# EasyEDA Pro project ProDocument_PCB6_2024-05-04.epro

# Board PCB6
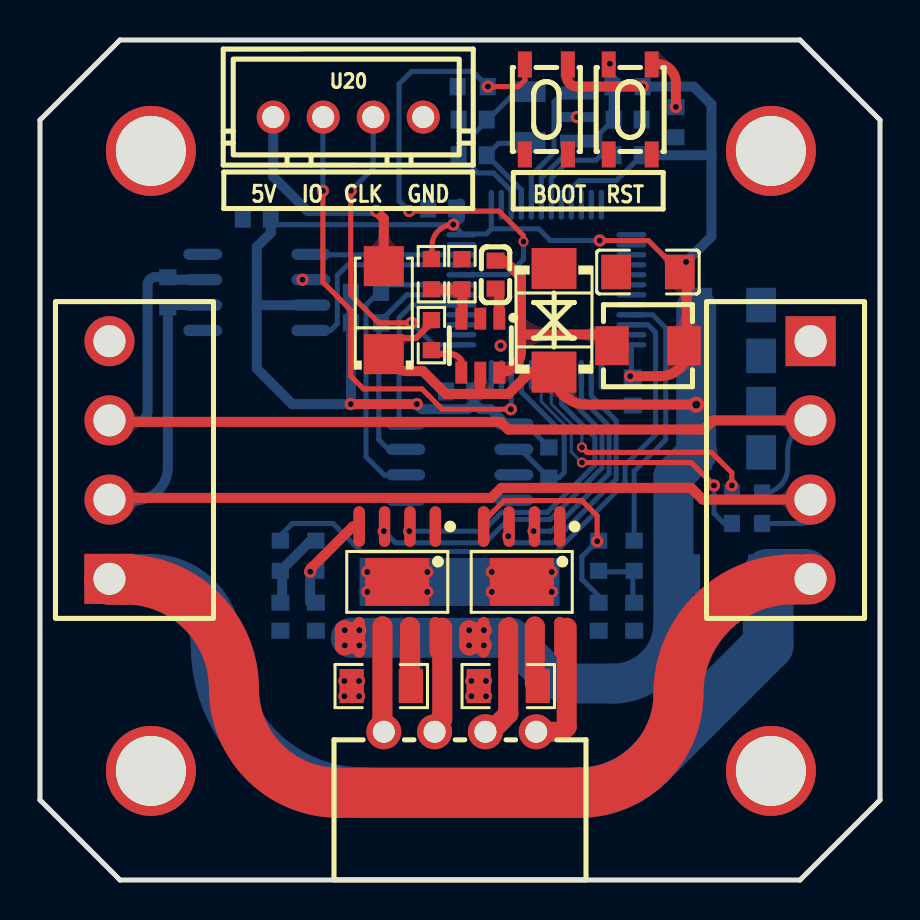
[diagram p0: board, top side]
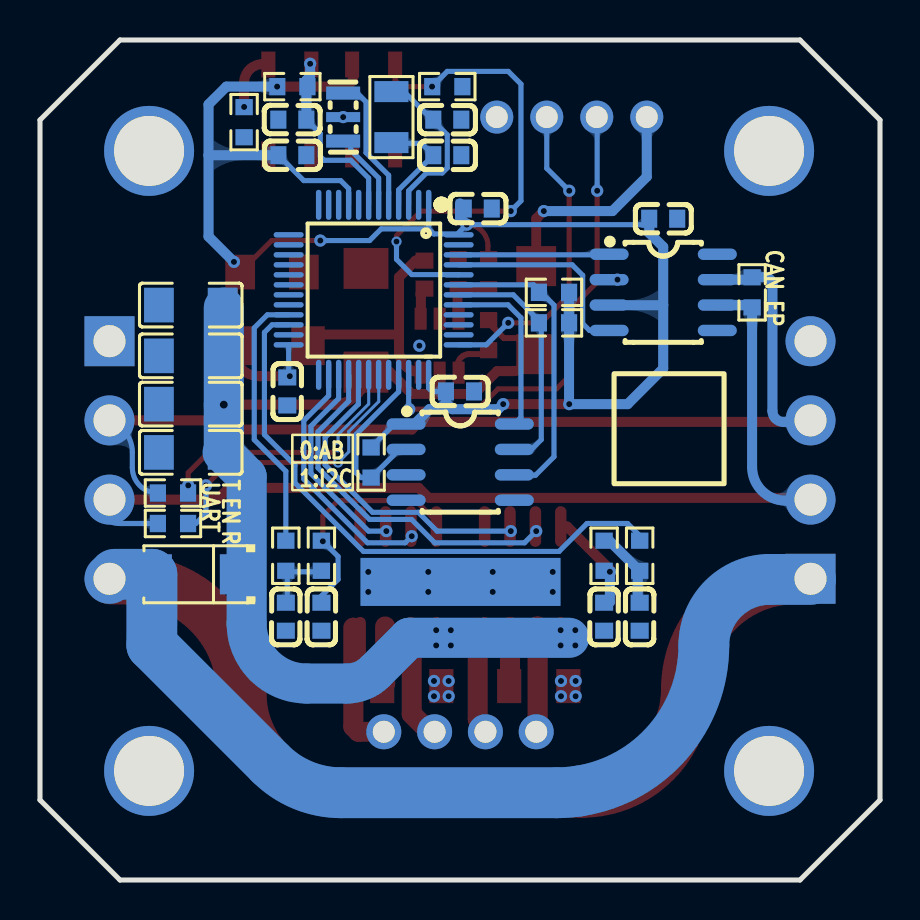
[diagram p1: board, bottom side, seen from below]

Outline 42 x 42 mm; copper layers: Top Layer, Bottom Layer. Coordinates in mm from the lower left corner of the outline.
Outline path: 0,38 0,4 4,0 38,0 42,4 42,38 38,42 4,42 0,38
Stack: Top Layer 0.035mm - / Dielectric1 1.51mm FR4 er 4.5 / Bottom Layer 0.035mm -

## Design rules (mm)
template: 自定义配置
spacing copperThickness1oz (default): track to track 0.102, other pairs 0.152 to 0.3
spacing copperThickness2oz: track to track 0.203, other pairs 0.152 to 0.3
track width copperThickness1oz (default): min 0.127, default 0.254, max 2.54
track width copperThickness2oz: min 0.203, default 0.254, max 2.54
differential pair differentialPair (default): width min 0.127, default 0.254, max 2.54; gap min 0.152, default 0.152
via viaSize (default): diameter min 0.5, default 0.61, max 10; hole min 0.3, default 0.305, max 6.3
net GND uses copperRegion1
net VM uses copperRegion1

## Placement (name value [footprint] x y rotation side)
C1  100nF  [C0603]  29.64 24.43 90 bottom
C2  100nF  [C0603]  29.38 36.24 0 bottom
C3  100nF  [C0603]  20.11 33.57 0 bottom
C4  100nF  [C0603]  22.78 30.27 90 top
C6  10uF  [C1206]  30.4 30.4 180 top
C7  100nF  [C0603]  21 24.43 0 bottom
C8  100nF  [C0603]  10.84 33.06 0 bottom
C9  100nF  [C0603]  29.71 13.16 90 bottom
C10  100nF  [C0603]  27.93 13.16 90 bottom
C11  100nF  [C0603]  12.02 13.16 90 bottom
C12  100nF  [C0603]  13.79 13.16 90 bottom
C13  10pF  [C0603]  21.64 38.02 0 bottom
C14  10pF  [C0603]  21.64 36.24 0 bottom
C15  100nF  [C0603]  29.38 38.02 180 bottom
C16  100uF  [C1206]  34.46 21.38 0 bottom
C17  100uF  [C1206]  34.46 23.79 0 bottom
C18  100uF  [C1206]  34.46 28.75 0 bottom
C19  100uF  [C1206]  34.46 26.21 0 bottom
CN3  XH-4AW  [CONN-TH_XH-4AW]  21 7.41 0 top
D1  SMBJ28CA  [SMB_L4.6-W3.6-LS5.3-BI]  25.7 27.98 90 top
L1  MCW-0420-4R7-N1-M  [IND-SMD_L4.5-W4.2]  30.4 26.71 180 top
NOREF  -  [Pad_e44]  36.55 36.45 0 top
NOREF#2  -  [Pad_e41]  36.55 5.45 0 top
NOREF#3  -  [Pad_e1729]  20.98 14.9 0 top
NOREF#4  -  [Pad_e43]  5.55 36.45 0 top
NOREF#5  -  [Pad_e42]  5.55 5.45 0 top
R1  62K  [R0603]  19.57 27.24 90 top
R2  7.5K  [R0603]  19.57 30.29 270 top
R3  2.4K  [R0603]  21.09 30.29 270 top
R4  10K  [R0603]  29.38 39.67 180 bottom
R5  1K  [R0603]  31.8 37.89 270 bottom
R7  10kΩ  [R0603]  21.64 39.67 0 bottom
R8  10kΩ  [R0603]  16.3 27.86 0 bottom
R9  10kΩ  [R0603]  16.3 29.38 0 bottom
R10  0.1R  [R1206]  23.41 9.7 180 top
R11  0.1R  [R1206]  17.06 9.7 180 top
R12  1kΩ  [R0603]  12.02 16.21 90 bottom
R13  1kΩ  [R0603]  13.79 16.21 270 bottom
R14  1kΩ  [R0603]  29.71 16.21 90 bottom
R15  1kΩ  [R0603]  27.93 16.21 90 bottom
R16  120Ω  [R0603]  6.4 29.38 90 bottom
R17  0Ω  [R0603]  35.35 17.82 0 bottom
R18  0Ω  [R0603]  35.35 19.35 0 bottom
R22  0Ω  [R0603]  25.44 20.87 270 bottom
SW1  TS-1089S-02526  [SW-SMD_4P-L4.2-W3.3-P2.15-LS5.1]  25.32 38.53 90 top
SW2  TS-1089S-02526  [SW-SMD_4P-L4.2-W3.3-P2.15-LS5.1]  29.51 38.53 90 top
U1  STM32F103C8T6  [LQFP-48_L7.0-W7.0-P0.50-LS9.0-BL]  25.32 29.51 0 bottom
U2  JW5026  [SOT-23-6_L2.9-W1.6-P0.95-LS2.8-BR]  22.02 26.71 90 top
U3  AS5600-ASOT  [SOIC-8_L5.0-W4.0-P1.27-LS6.0-BL]  20.99 20.89 270 bottom
U4  SN65HVD232DR  [SOIC-8_L5.0-W4.0-P1.27-LS6.0-BL]  10.84 29.38 270 bottom
U5  TB67H450FNG,EL  [HSOP-8_L5.0-W4.0-P1.27-LS6.2-BL-EP]  17.86 14.9 180 top
U6  TB67H450FNG,EL  [HSOP-8_L5.0-W4.0-P1.27-LS6.2-BL-EP]  24.09 14.9 180 top
U7  1N4007  [SMA_L4.3-W2.6-LS5.1-RD]  34.21 15.28 0 bottom
U8  1N4007  [SMA_L4.3-W2.6-LS5.1-RD]  17.19 28.49 90 top
U12  XY-VH3.96-4A11  [CONN-TH_4P-P3.96_XYECONN_XY-VH3.96-4A11]  38.53 21 270 top
U13  XY-VH3.96-4A11  [CONN-TH_4P-P3.96_XYECONN_XY-VH3.96-4A11]  3.47 21 90 top
U20  XH-4A  [CONN-TH_XH2.50-4P]  15.41 38.14 180 top
X1  8MHz  [OSC-SMD_3P-L3.2-W1.3-P1.2-L]  26.84 38.14 90 bottom
X2  32.768kHz  [OSC-SMD_L3.2-W1.5]  24.43 38.14 90 bottom

## Footprints (pads in the part's own frame, mm; a bottom-side part is the same pattern mirrored in y, then rotated)
C0603
  rect 0.8x0.9 smd: 1(-0.7,0) 2(0.7,0)
C1206
  rect 1.485x1.728 smd: 1(-1.593,0) 2(1.593,0)
CONN-TH_4P-P3.96_XYECONN_XY-VH3.96-4A11
  rect 2.5x2.5 hole 1.6: 1(-5.94,0)
  round 2.5 hole 1.6: 2(-1.98,0) 3(1.98,0) 4(5.94,0)
CONN-TH_XH2.50-4P
  round 1.65 hole 1.1: 1(-3.75,0) 2(-1.25,0) 3(1.25,0) 4(3.75,0)
CONN-TH_XH-4AW
  round 1.75 hole 1.1: 1(-3.81,0) 2(-1.27,0) 3(1.27,0) 4(3.81,0)
HSOP-8_L5.0-W4.0-P1.27-LS6.2-BL-EP
  oval 0.574x2.038 smd: 1(-1.905,-2.769) 2(-0.635,-2.769) 3(0.635,-2.769) 4(1.905,-2.769) 5(1.905,2.769) 6(0.635,2.769) 7(-0.635,2.769) 8(-1.905,2.769)
  rect 3.2x2.4 smd: 9(0,0)
IND-SMD_L4.5-W4.2
  rect 1.675x1.95 smd: 1(-1.8,0) 2(1.8,0)
LQFP-48_L7.0-W7.0-P0.50-LS9.0-BL
  oval 0.27x1.5 smd: 1(-2.75,-4.25) 2(-2.25,-4.25) 3(-1.75,-4.25) 4(-1.25,-4.25) 5(-0.75,-4.25) 6(-0.25,-4.25) 7(0.25,-4.25) 8(0.75,-4.25) 9(1.25,-4.25) 10(1.75,-4.25) 11(2.25,-4.25) 12(2.75,-4.25) 25(2.75,4.25) 26(2.25,4.25) 27(1.75,4.25) 28(1.25,4.25) 29(0.75,4.25) 30(0.25,4.25) 31(-0.25,4.25) 32(-0.75,4.25) 33(-1.25,4.25) 34(-1.75,4.25) 35(-2.25,4.25) 36(-2.75,4.25)
  oval 1.5x0.27 smd: 13(4.25,-2.75) 14(4.25,-2.25) 15(4.25,-1.75) 16(4.25,-1.25) 17(4.25,-0.75) 18(4.25,-0.25) 19(4.25,0.25) 20(4.25,0.75) 21(4.25,1.25) 22(4.25,1.75) 23(4.25,2.25) 24(4.25,2.75) 37(-4.25,2.75) 38(-4.25,2.25) 39(-4.25,1.75) 40(-4.25,1.25) 41(-4.25,0.75) 42(-4.25,0.25) 43(-4.25,-0.25) 44(-4.25,-0.75) 45(-4.25,-1.25) 46(-4.25,-1.75) 47(-4.25,-2.25) 48(-4.25,-2.75)
OSC-SMD_3P-L3.2-W1.3-P1.2-L
  rect 0.65x1.7 smd: 1(-1.2,0) 3(1.2,0)
  rect 0.5x1.7 smd: 2(0,0)
OSC-SMD_L3.2-W1.5
  rect 1.05x1.7 smd: 1(-1.275,0) 2(1.275,0)
Pad_e41
  round 4.5 hole 3.5: 2(0,0)
Pad_e42
  round 4.5 hole 3.5: 1(0,0)
Pad_e43
  round 4.5 hole 3.5: 4(0,0)
Pad_e44
  round 4.5 hole 3.5: 3(0,0)
Pad_e1729
  rect 10x2.4 smd far side: 49(0,0)
R0603
  rect 0.806x0.864 smd: 1(-0.753,0) 2(0.753,0)
R1206
  rect 1.208x1.701 smd: 1(-1.479,0) 2(1.479,0)
SMA_L4.3-W2.6-LS5.1-RD
  rect 2x2 smd: 1(-2.2,0) 2(2.2,0)
SMB_L4.6-W3.6-LS5.3-BI
  rect 2.047x2.241 smd: 1(-2.591,0) 2(2.591,0)
SOIC-8_L5.0-W4.0-P1.27-LS6.0-BL
  oval 0.569x1.95 smd: 1(-1.905,-2.705) 2(-0.635,-2.705) 3(0.635,-2.705) 4(1.905,-2.705) 5(1.905,2.705) 6(0.635,2.705) 7(-0.635,2.705) 8(-1.905,2.705)
SOT-23-6_L2.9-W1.6-P0.95-LS2.8-BR
  rect 1.1x0.6 smd: 1(1.35,-0.95) 2(1.35,0) 3(1.35,0.95) 4(-1.35,0.95) 5(-1.35,0) 6(-1.35,-0.95)
SW-SMD_4P-L4.2-W3.3-P2.15-LS5.1
  rect 1.3x0.7 smd: 1(-2.25,1.075) 2(2.25,1.075) 3(-2.25,-1.075) 4(2.25,-1.075)

## Nets
3V3: C1.2 C2.2 C3.2 C6.1 C7.2 C8.2 L1.1 R2.1 R4.1 R8.1 R9.1 R22.1 SW1.4 U1.1 U1.9 U1.24 U1.36 U1.48 U3.1 U4.3
5V: U8.2 U20.4
GND: C1.1 C2.1 C3.1 C6.2 C7.1 C8.1 C9.1 C10.1 C11.1 C12.1 C13.1 C14.1 C15.1 C16.2 C17.2 C18.2 C19.2 D1.2 NOREF.3 NOREF#2.2 NOREF#3.49 NOREF#4.4 NOREF#5.1 R3.1 R5.2 R7.1 R10.2 R11.2 U1.8 U1.23 U1.35 U1.47 U2.2 U3.4 U4.2 U5.1 U5.9 U6.1 U6.9 U12.1 U13.4 U20.1 X1.2
A+: CN3.1 U5.6
A-: CN3.2 U5.8
B+: CN3.4 U6.8
B-: CN3.3 U6.6
BOOT: R7.2 SW1.2 U1.44
CANH: R16.2 R18.2 U4.7 U12.2 U13.3
CANL: R16.1 R17.2 U4.6 U12.3 U13.2
CANRX: U1.45 U4.4
CANTX: U1.46 U4.1
ENCODER_DIR_Z: U1.41 U3.8
ENCODER_MODE: R22.2 U1.33 U3.2
ENCODER_SCL: R8.2 U1.42 U3.7
ENCODER_SDA: R9.2 U1.43 U3.6
IN_A+: U1.28 U5.3
IN_A-: U1.29 U5.2
IN_B+: U1.27 U6.2
IN_B-: U1.26 U6.3
OSC_IN: U1.5 X1.3
OSC_OUT: U1.6 X1.1
PC14: C13.2 U1.3 X2.2
PC15: C14.2 U1.4 X2.1
PWMA: R12.2 U1.22
PWMB: R14.2 U1.21
RST: C15.2 R4.2 SW2.2 U1.7
SWCLK: U1.37 U20.2
SWDIO: U1.34 U20.3
UART_RX: R17.1 U1.31
UART_TX: R18.1 U1.30
VM: C16.1 C17.1 C18.1 C19.1 D1.1 R1.2 U2.5 U5.5 U6.5 U7.1 U8.1
VM_IN: U7.2 U12.4 U13.1
$1N841: R1.1 U2.4
$1N850: C4.1 U2.1
$1N855: C4.2 L1.2 U2.6
$1N856: R2.2 R3.2 U2.3
$1N2865: C11.2 R12.1 R13.1
$1N2867: C12.2 R13.2 U5.4
$1N2976: C9.2 R14.1 R15.1
$1N2985: C10.2 R15.2 U6.4
$1N3043: R11.1 U5.7
$1N3069: R10.1 U6.7
$1N14430: R5.1 SW2.4

Pads without a net: SW1 1 3; SW2 1 3; U1 2 10 11 12 13 14 15 16 17 18 19 20 25 32 38 39 40; U3 3 5; U4 5 8

## Via types
v1: diameter 0.61, hole 0.305, Top Layer to Bottom Layer, 51 vias
v2: diameter 0.5, hole 0.3, Top Layer to Bottom Layer, 3 vias
v3: diameter 0.8, hole 0.4, Top Layer to Bottom Layer, 1 via

## Routing (per net, layer and track width the routed paths; a pad name or vN(x,y) marks a point on that pad's centre or on a via; arc(x,y) is an arc through that point)
3V3: length 94
  Top Layer w0.254: 19.6,31.03 19.6,31.71 arc(19.91,32.46) v1(20.66,32.77) ; C6.1 30.42,31.97 v1(27.99,31.97)
  Top Layer w0.5: v1(15.54,23.79) v1(18.84,23.79) ; v1(30.14,39.67) 26.86,39.67 arc(26.49,39.82) 26.33,40.19 26.33,40.68 ; v1(29.51,25.19) 31.03,25.19 arc(31.96,25.57) 32.34,26.5 32.34,30.1
  Bottom Layer w0.254: v1(27.99,31.97) 25.52,31.97 24.94,32.56 22.57,32.56 ; v1(29.51,25.19) 29.57,25.25 U1.24 ; C8.2 11.84,32.77 v1(20.66,32.77) 21.13,32.3 22.31,32.3 22.57,32.56 ; 22.57,32.56 22.57,34.27 ; 24.3,22.72 24.36,22.72 25.57,21.51 ; C2.2 28.81,34.97 26.97,34.97 26.57,34.57 U1.9 ; U1.36 22.57,24.6 22.4,24.43 C7.2 ; v1(30.14,39.67) 30.14,39.66 arc(30.14,39.67) R4.1
  Bottom Layer w0.5: 12.71,28.74 10.84,28.74 ; 10.84,28.74 10.84,25.57 12.62,23.79 v1(15.54,23.79) 15.55,23.8 R8.1 R9.1 ; 10.84,28.74 10.84,31.66 11.54,32.36 C8.2 ; 33.57,36.24 33.57,32.18 v1(32.3,30.91) ; 33.57,36.24 C2.2 ; 33.57,36.24 33.57,38.78 32.68,39.67 v1(30.14,39.67) R4.1 ; 21.7,23.86 22.02,23.54 22.53,23.54 23.2,22.88 ; 21.7,23.86 21.38,23.54 19.09,23.54 v1(18.84,23.79) ; 21.7,23.86 C7.2 ; v1(20.66,32.77) 21,33.1 21,33.83
5V: length 11.8
  Top Layer w0.5: U8.2 17.19,33.06 v1(16.81,33.45)
  Bottom Layer w0.5: U20.4 11.66,35.16 13.38,33.45 v1(16.81,33.45)
GND:
  vias: v1(13.13,30.02) v1(15.22,9.95) v1(15.22,9.19) v1(15.95,9.95) v1(15.95,9.19) v1(16.36,15.4) v1(16.36,14.4) v1(19.36,15.4) v1(19.36,14.4) v1(21.57,9.95) v1(21.57,9.19) v1(22.3,9.95) v1(22.3,9.19) v1(22.59,15.4) v1(22.59,14.4) v1(23.03,26.71) v1(25.59,15.4) v1(25.59,14.4) v1(26.84,38.14)
A+: length 5.3
  Top Layer w1: CN3.1 17.12,7.48 17.12,12.69
A-: length 5.4
  Top Layer w1: 20.11,12.62 20.11,8.05 19.73,7.66 CN3.2
B+: length 6.6
  Top Layer w1: 26.33,12.62 26.33,7.66 26.08,7.41 CN3.4
B-: length 5.8
  Top Layer w1: CN3.3 22.52,7.41 23.41,8.3 23.41,12.62
BOOT: length 25.2
  Top Layer w0.254: 24.24,40.78 24.24,39.99 23.92,39.67 v1(22.4,39.67) ; v1(18.46,33.45) 22.95,33.45 24.18,32.22 v2(24.18,31.92)
  Bottom Layer w0.254: v1(22.4,39.67) 21.64,40.43 18.59,40.43 17.95,39.8 17.95,33.95 v1(18.46,33.45) ; v2(24.18,31.92) 24.18,31.03 23.41,30.27 21.06,30.27 arc(21.06,30.27) U1.44
CANH: length 52.5
  Top Layer w0.5: 3.47,22.9 23.03,22.9 23.41,22.52 33.19,22.52 33.65,22.98 U12.2
  Bottom Layer w0.254: 39.29,23.03 39.03,23.03 arc(37.87,22.55) 37.38,21.38 37.38,20.62 arc(37.01,19.72) 36.11,19.35
  Bottom Layer w0.5: 3.47,22.9 4.83,22.9 arc(5.22,23.07) 5.38,23.46 5.38,29.76 arc(5.49,30.03) 5.76,30.14 6.4,30.14 arc(6.43,30.05) 6.52,30.02 8.05,30.02
CANL: length 52.5
  Top Layer w0.5: 4.1,19.11 22.57,19.11 23.07,19.61 32.55,19.61 33.14,19.02 U12.3
  Bottom Layer w0.254: 36.11,17.82 38.02,17.82 arc(38.92,18.2) 39.29,19.09
  Bottom Layer w0.5: 8.17,28.75 6.52,28.75 arc(6.43,28.71) 6.4,28.62 6.4,20.65 arc(5.9,19.46) 4.72,18.97 3.47,18.97
CANRX: length 10.7
  Bottom Layer w0.254: U1.45 15.39,30.76 14.87,30.23 14.87,27.82 14.52,27.48 13.16,27.48
CANTX: length 7.5
  Bottom Layer w0.254: U4.1 13.57,31.26 U1.46
ENCODER_DIR_Z: length 8.8
  Bottom Layer w0.254: U3.8 17.95,23.13 17.95,28.11 18.6,28.76 U1.41
ENCODER_MODE: length 9
  Bottom Layer w0.254: U1.33 24.07,24.41 26.21,22.27 26.21,20.37 25.95,20.12 25.57,20.12 ; 23.67,21.51 24.05,21.51 25.57,19.98
ENCODER_SCL: length 12
  Bottom Layer w0.254: U1.42 18.34,29.26 16.94,27.86 16.94,22.02 17.44,21.51 18.21,21.51
ENCODER_SDA: length 15.2
  Bottom Layer w0.254: U1.43 17.31,29.76 16.3,28.75 16.3,21.16 17.22,20.24 18.33,20.24
IN_A+: length 18
  Bottom Layer w0.254: U1.28 26.57,23.94 28.1,22.41 28.1,20.61 25.52,18.03 23.43,18.03 22.26,16.86 17.77,16.86 v1(17.19,17.44)
IN_A-: length 16
  Bottom Layer w0.254: 26.08,25.44 26.08,23.79 27.74,22.13 27.74,20.76 25.37,18.38 23.08,18.38 22.14,17.44 v1(18.46,17.44)
IN_B+: length 11
  Bottom Layer w0.254: 27.07,25.77 27.07,24.08 28.45,22.69 28.45,20.33 25.57,17.44 v1(24.68,17.44)
IN_B-: length 13.1
  Bottom Layer w0.254: v1(23.41,17.19) 23.74,16.86 25.62,16.86 28.81,20.05 28.81,22.97 27.57,24.21 27.57,25.77
OSC_IN: length 6.4
  Bottom Layer w0.254: 24.57,34.27 24.57,35.24 25.7,36.37 25.7,38.91 26.14,39.34 X1.3
OSC_OUT: length 3
  Bottom Layer w0.254: 26.46,36.69 26.46,36.49 25.07,35.1 25.07,34.27
PC14: length 8.4
  Bottom Layer w0.254: U1.3 23.57,34.46 22.68,35.35 21.89,35.35 21.64,35.6 21.64,37.26 23.8,39.42 X2.2
PC15: length 5.4
  Bottom Layer w0.254: 24.28,36.83 22.93,36.83 C14.2 24.07,34.51 U1.4
PWMA: length 29.4
  Bottom Layer w0.254: U1.22 30.4,27.76 30.78,27.38 30.78,22.27 29.25,20.75 29.25,19.86 25.83,16.43 16.05,16.43 14.65,17.82 12.62,17.82 11.76,16.97
PWMB: length 13.3
  Bottom Layer w0.254: R14.2 29.71,20.44 31.29,22.02 31.29,27.6 30.63,28.26 U1.21
RST: length 9.2
  Bottom Layer w0.254: U1.7 25.57,35.09 26.46,35.98 27.79,35.98 27.99,36.18 27.99,37.32 C15.2
  Bottom Layer w0.5: C15.2 28.68,39.99 28.49,40.18 v1(28.49,40.81)
SWCLK: length 15.9
  Top Layer w0.254: v1(18.59,27.86) 16.94,27.86 15.54,29.25 v1(15.54,34.46)
  Bottom Layer w0.254: v1(15.54,34.46) 16.66,35.58 U20.2 ; v1(18.59,27.86) 19.69,26.76 U1.37
SWDIO: length 24
  Top Layer w0.254: v1(23.54,23.54) 20.11,23.54 19.09,24.56 16.17,24.56 15.54,25.19 15.54,28.49 14.14,29.89 v1(14.14,34.46)
  Bottom Layer w0.254: v1(23.54,23.54) 23.57,23.57 U1.34 ; U20.3 14.14,38.12 v1(14.14,34.46)
UART_RX: length 14.3
  Top Layer w0.254: v2(27.1,20.87) 32.56,20.87 v1(33.7,19.73)
  Bottom Layer w0.15: v2(27.1,20.87) 26.56,21.41 26.56,22.42 25.06,23.92 25.06,24.79
  Bottom Layer w0.254: 34.59,17.82 34.21,17.82 33.7,18.33 v1(33.7,19.73)
UART_TX: length 12.8
  Top Layer w0.254: v2(27.1,21.63) 27.35,21.38 33.57,21.38 34.59,20.36 v1(34.59,19.73)
  Bottom Layer w0.15: v2(27.1,21.63) 27.1,22.27 25.57,23.8 25.57,25.18
VM: length 60.2
  Top Layer w0.3: 17.83,27.1 18.81,27.1 19.57,27.86 R1.2
  Top Layer w0.5: v3(32.81,23.77) 27.32,23.77 arc(26.18,24.24) D1.1 24.5,25.39 23.41,24.3 22.03,24.3 ; 22.03,24.3 20.29,24.3 19.15,25.44 18.34,25.44 arc(17.74,25.69) 17.49,26.3 ; 22.03,24.3 arc(22.02,24.3) 22.02,24.31 22.02,25.32
  Top Layer w0.8: v1(15.24,11.73) 15.92,11.73 ; v1(15.24,12.49) 15.92,12.49 ; v1(21.46,11.73) v1(22.19,11.73) ; v1(21.46,12.49) v1(22.19,12.49)
  Top Layer w1: v1(21.46,12.49) v1(21.46,11.73) ; v1(15.24,12.49) v1(15.24,11.73)
  Bottom Layer w2: 32.81,21.38 v3(32.81,23.77) 32.81,28.62 ; C16.1 31.67,20.18 31.67,12.82 arc(30.79,10.7) 28.67,9.82 26.65,9.82 arc(25.89,9.98) 25.24,10.41 23.54,12.11 15.54,12.11
  vias: v1(15.97,12.49) v1(15.97,11.73)
VM_IN: length 94.4
  Top Layer w2.5: 38.46,15.03 37.64,15.03 arc(33.6,13.36) 31.92,9.32 arc(30.47,5.81) 26.97,4.36 14.9,4.36 arc(11.22,5.89) 9.7,9.57 arc(8.1,13.43) 4.24,15.03
  Top Layer w2.54: 4.24,15.03 3.47,15.03
  Bottom Layer w2.54: 3.47,15.03 5.51,15.03 arc(7.84,14.06) 8.81,11.73 arc(10.58,6.93) 15.05,4.45 arc(15.61,4.38) 16.17,4.36 26.95,4.36 arc(28.86,4.74) 30.49,5.83 36.41,11.75 U7.2 38.27,15.28
$1N841: length 2.3
  Top Layer w0.3: 19.6,26.3 20.53,26.3 arc(20.95,26.12) 21.13,25.7 21.13,25.44 arc(21.09,25.36) 21,25.32
$1N850: length 1.5
  Top Layer w0.5: 22.96,28.14 22.96,29.33 arc(22.91,29.46) 22.78,29.51
$1N855: length 11.7
  Top Layer w0.5: 24.05,27.28 24.05,26.45 arc(23.74,25.7) 22.99,25.39 ; 24.05,27.28 24.05,30.14 23.22,30.97 C4.2 ; 24.05,27.28 28.04,27.28 L1.2
$1N856: length 3
  Top Layer w0.5: 21.13,27.98 21.13,29.51 19.68,29.51 arc(19.65,29.52) 19.64,29.54
$1N2865: length 3.9
  Bottom Layer w0.5: R13.1 13.54,16.97 12.11,15.54 12.11,13.89
$1N2867: length 5
  Top Layer w0.5: U5.4 15.64,17.67 13.51,15.54 v1(13.51,15.41)
  Bottom Layer w0.5: 13.54,13.86 13.51,13.9 v1(13.51,15.41)
$1N2976: length 3.3
  Bottom Layer w0.254: 29.64,13.89 29.64,15.41 28.03,15.41 27.93,15.51
$1N2985: length 11.9
  Top Layer w0.254: 22.17,17.5 22.17,17.92 23.22,18.97 27.09,18.97 27.86,18.21 v1(27.86,16.94)
  Bottom Layer w0.254: v1(27.86,16.94) 27.1,16.17 27.1,15.03 27.93,14.2 C10.2
$1N3043: length 3
  Top Layer w1: 18.5,12.66 18.5,9.74 R11.1
$1N3069: length 3
  Top Layer w1: 24.74,12.68 24.74,9.85 R10.1
$1N14430: length 3
  Top Layer w0.5: v1(31.8,38.65) 31.8,39.87 arc(31.52,40.52) 30.87,40.79 30.6,40.79 SW2.4

## Copper pours and planes (outline as drawn; the poured copper is in the pictures)
GND on Top Layer: -2.88,44.37 44.24,44.37 44.24,-1.86 -2.88,-1.86
GND on Bottom Layer: -1.22,42.97 43.22,42.97 43.22,-1.48 -1.22,-1.48

Small or netless copper shapes (teardrops, artwork), in the pictures only: 53 on Top Layer, 95 on Bottom Layer

## Text on the board
Bottom Silkscreen Layer: CAN_EP | T | EN | R | UART | 0:AB | 1:I2C
Top Solder Mask Layer: G | H | L | V
Top Silkscreen Layer: 5V | IO | CLK | GND | BOOT | RST
